# Altium schematic sheet SP26_FindingTitan_Filt&post_Amp_Michael_Krueger.SchDoc
size A; SheetNumber: 2; SheetTotal: 6
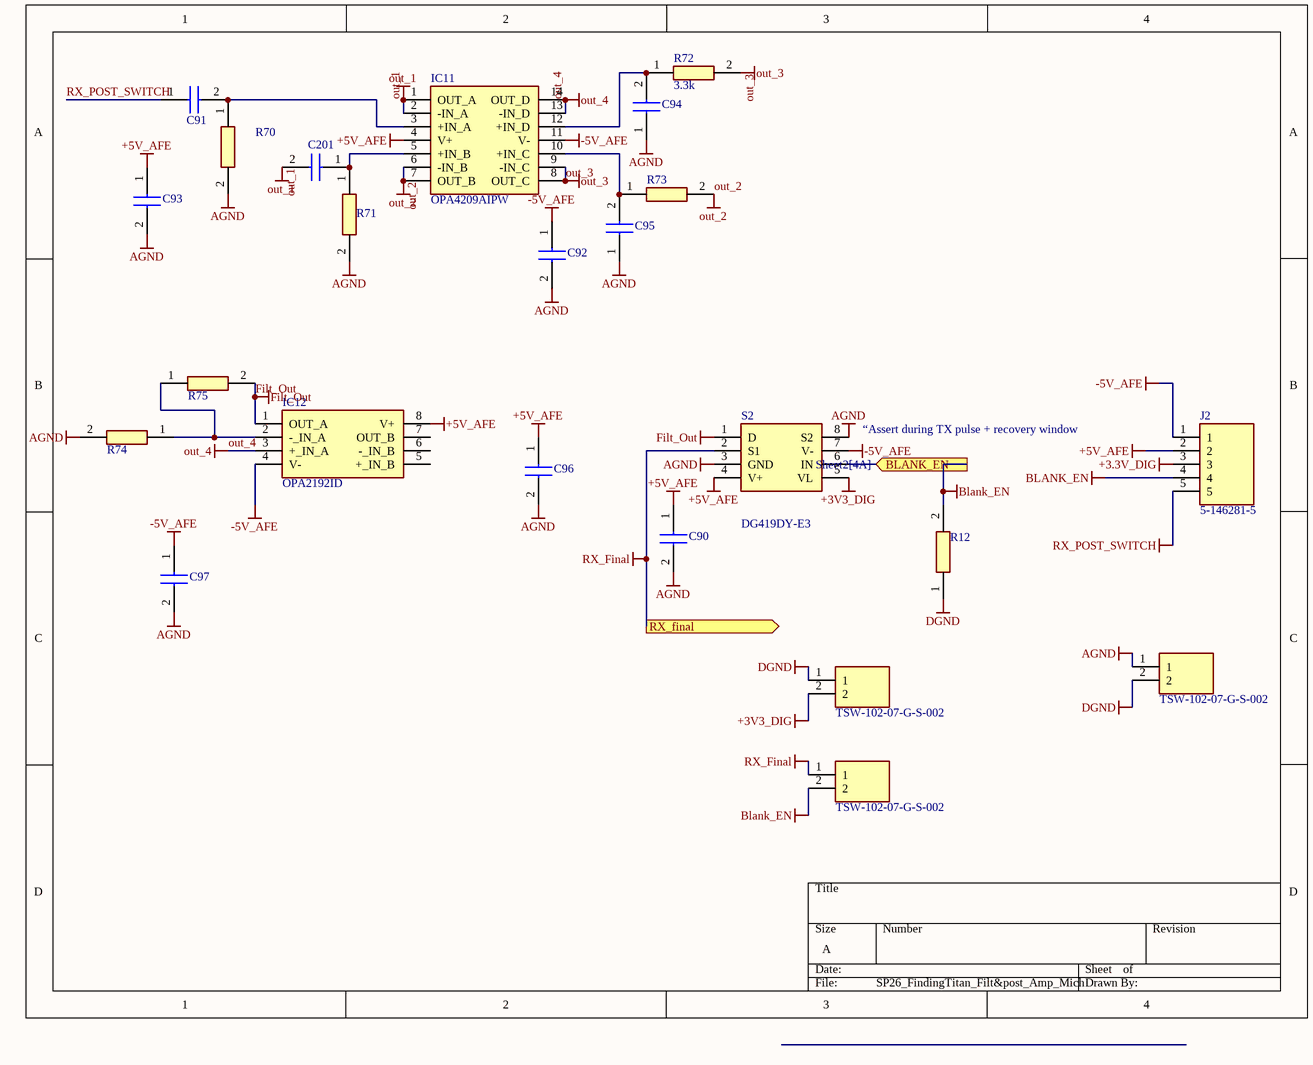
[diagram p0: SP26_FindingTitan_Filt&post_Amp_Michael_Krueger.SchDoc]

## Parts
C90  GRM188R71H104KA93B  [CAPC1608X90N]  (value not drawn)
C91  GCM1885C1H103JA16D  [CAPC1608X90N]  (value not drawn)
C92  GRM188R71H104KA93B  [CAPC1608X90N]  (value not drawn)
C93  GRM188R71H104KA93B  [CAPC1608X90N]  (value not drawn)
C94  GCM1885C1H103JA16D  [CAPC1608X90N]  (value not drawn)
C95  GCM1885C1H103JA16D  [CAPC1608X90N]  (value not drawn)
C96  GRM188R71H104KA93B  [CAPC1608X90N]  (value not drawn)
C97  GRM188R71H104KA93B  [CAPC1608X90N]  (value not drawn)
C201  GCM1885C1H103JA16D  [CAPC1608X90N]  (value not drawn)
IC11  OPA4209AIPW  [SOP65P640X120-14N]
IC12  OPA2192ID  [SOIC127P600X175-8N]
J0  TSW-102-07-G-S-002  [HDRV2W64P0X254_1X2_508X254X838P]
J2  5-146281-5  [HDRV5W67P0X254_1X5_1229X234X821P]
J22  TSW-102-07-G-S-002  [HDRV2W64P0X254_1X2_508X254X838P]
J69  TSW-102-07-G-S-002  [HDRV2W64P0X254_1X2_508X254X838P]
R12  TNPW0805100KBEEA  [RESC2012X55N]  (value not drawn)
R70  20k  [RESC1608X60N]  (value not drawn)
R71  20k  [RESC1608X60N]  (value not drawn)
R72  3.3k  [RESC1608X60N]
R73  3.3k  [RESC1608X60N]  (value not drawn)
R74  20k  [RESC1608X60N]  (value not drawn)
R75  20k  [RESC1608X60N]  (value not drawn)
S2  DG419DY-E3  [SOIC127P600X175-8N]

## Ports
BLANK_EN (in, see Sheet2[4A]), RX_final (out)

## Nets
+3.3V_DIG: J2.3
+3V3_DIG: J69.2 S2.5(VL)
+5V_AFE: C90.1 C93.1 C96.1 IC11.4(V+) IC12.8(V+) J2.2 S2.4(V+)
-5V_AFE: C92.1 C97.1 IC11.11(V-) IC12.4(V-) J2.1 S2.7(V-)
AGND: C90.2 C92.2 C93.2 C94.1 C95.1 C96.2 C97.2 J22.1 R70.2(R2) R71.2(R2) R74.2(R2) S2.3(GND) S2.8(S2)
BLANK_EN: J0.2 J2.4 R12.2 S2.6(IN) ; port BLANK_EN
DGND: J22.2 J69.1 R12.1
Filt_Out: IC12.1(OUT_A) R75.2(R2) S2.1(D)
out_1: C201.2 IC11.1(OUT_A) IC11.2(-IN_A)
out_2: IC11.6(-IN_B) IC11.7(OUT_B) R73.2(R2)
out_3: IC11.8(OUT_C) IC11.9(-IN_C) R72.2(R2)
out_4: IC11.13(-IN_D) IC11.14(OUT_D) IC12.3(+_IN_A)
RX_Final: J0.1 S2.2(S1) ; port RX_final
RX_POST_SWITCH: C91.1 J2.5
NetC91_2: C91.2 IC11.3(+IN_A) R70.1(R1)
NetC94_2: C94.2 IC11.12(+IN_D) R72.1(R1)
NetC95_2: C95.2 IC11.10(+IN_C) R73.1(R1)
NetC201_1: C201.1 IC11.5(+IN_B) R71.1(R1)
NetIC12_2: IC12.2(-_IN_A) R74.1(R1) R75.1(R1)

Not connected (* = marked no-connect by the designer): IC12 5(+_IN_B) 6(-_IN_B) 7(OUT_B)

## Notes on the sheet
- (near S2) “Assert during TX pulse + recovery window

## Library data of the parts
C90 C92 C93 C96 C97 = GRM188R71H104KA93B: Capacitor; Manufacturer_Name: Murata Electronics; Datasheet Link: http://componentsearchengine.com/Datasheets/1/GRM188R71H104KA93B.pdf; Height: 0.9mm; Manufacturer_Part_Number: GRM188R71H104KA93B; Mouser Part Number: N/A; Mouser Price/Stock: https://www.mouser.co.uk/ProductDetail/Murata-Electronics/GRM188R71H104KA93B?qs=UOvNgVTuGCrHGVnSgRWyLQ%3D%3D
C91 C94 C95 C201 = GCM1885C1H103JA16D: Capacitor; Manufacturer_Name: Murata Electronics; Datasheet Link: https://search.murata.co.jp/Ceramy/image/img/A01X/G101/ENG/GCM1885C1H103JA16-01A.pdf; Height: 0.9mm; Manufacturer_Part_Number: GCM1885C1H103JA16D; Mouser Part Number: N/A; Mouser Price/Stock: https://www.mouser.com/Search/Refine.aspx?Keyword=N%2FA
IC11 = OPA4209AIPW: Integrated Circuit; Manufacturer_Name: Texas Instruments; Datasheet Link: http://www.ti.com/lit/ds/symlink/opa4209.pdf; Height: 1.2mm; Manufacturer_Part_Number: OPA4209AIPW; Mouser Part Number: 595-OPA4209AIPW; Mouser Price/Stock: https://www.mouser.co.uk/ProductDetail/Texas-Instruments/OPA4209AIPW?qs=hEBn5lgDlCqr0lWeKFs%252BSA%3D%3D; Arrow Part Number: OPA4209AIPW; Arrow Price/Stock: https://www.arrow.com/en/products/opa4209aipw/texas-instruments?region=nac
IC12 = OPA2192ID: Integrated Circuit; Manufacturer_Name: Texas Instruments; Datasheet Link: http://www.ti.com/lit/ds/symlink/opa2192.pdf; Height: 1.75mm; Manufacturer_Part_Number: OPA2192ID; Mouser Part Number: 595-OPA2192ID; Mouser Price/Stock: https://www.mouser.co.uk/ProductDetail/Texas-Instruments/OPA2192ID?qs=U0ECReq1GB8SZ%252BXtlidzLA%3D%3D; Arrow Part Number: OPA2192ID; Arrow Price/Stock: https://www.arrow.com/en/products/opa2192id/texas-instruments?utm_currency=USD&region=nac
J0 J22 J69 = TSW-102-07-G-S-002: Connector; Manufacturer_Name: SAMTEC; Datasheet Link: http://suddendocs.samtec.com/prints/tsw-xxx-xx-xxx-x-xx-xxx-mkt.pdf; Height: 8.38mm; Manufacturer_Part_Number: TSW-102-07-G-S-002; Mouser Part Number: 200-TSW-10207GS002; Mouser Price/Stock: https://www.mouser.co.uk/ProductDetail/Samtec/TSW-102-07-G-S-002?qs=icabnvfcbsHvpvHCodBv1Q%3D%3D; Arrow Part Number: TSW-102-07-G-S-002; Arrow Price/Stock: https://www.arrow.com/en/products/tsw-102-07-g-s-002/samtec?utm_currency=USD&region=nac
J2 = 5-146281-5: Connector; Manufacturer_Name: TE Connectivity; Datasheet Link: https://www.te.com/commerce/DocumentDelivery/DDEController?Action=showdoc&DocId=Customer+Drawing%7F146281%7FG2%7Fpdf%7FEnglish%7FENG_CD_146281_G2.pdf%7F5-146281-5; Height: 8.21mm; Manufacturer_Part_Number: 5-146281-5; Mouser Part Number: 571-5-146281-5; Mouser Price/Stock: https://www.mouser.co.uk/ProductDetail/TE-Connectivity/5-146281-5?qs=bwpFY26eRVcDY9brDBVAcw%3D%3D; Arrow Part Number: 5-146281-5; Arrow Price/Stock: https://www.arrow.com/en/products/5-146281-5/te-connectivity?region=nac
R12 = TNPW0805100KBEEA: Resistor; Manufacturer_Name: Vishay; Datasheet Link: http://www.farnell.com/datasheets/2609085.pdf; Height: 0.55mm; Manufacturer_Part_Number: TNPW0805100KBEEA; Mouser Part Number: 71-TNPW0805100KBEEA; Mouser Price/Stock: https://www.mouser.co.uk/ProductDetail/Vishay-Dale/TNPW0805100KBEEA?qs=CqEPuS5aiX%252B%2Fw%252BT8t4N3Zg%3D%3D; Arrow Part Number: TNPW0805100KBEEA; Arrow Price/Stock: https://www.arrow.com/en/products/tnpw0805100kbeea/vishay?region=nac
R70 R71 R74 R75 = RR0816P-103-D: Resistor; Manufacturer_Name: Susumu; Datasheet Link: http://componentsearchengine.com/Datasheets/1/RR0816P-103-D.pdf; Manufacturer_Part_Number: RR0816P-103-D; Mouser Part Number: 754-RR0816P-103D; Mouser Price/Stock: https://www.mouser.co.uk/ProductDetail/Susumu/RR0816P-103-D?qs=nCAm%252BcMdy9zJFUifGf2vtQ%3D%3D; Arrow Part Number: RR0816P-103-D; Arrow Price/Stock: https://www.arrow.com/en/products/rr0816p-103-d/susumu
R72 R73 = RR0816P-104-D: Resistor; Manufacturer_Name: Susumu; Manufacturer_Part_Number: RR0816P-104-D; Mouser Part Number: 754-RR0816P-104D; Mouser Price/Stock: https://www.mouser.co.uk/ProductDetail/Susumu/RR0816P-104-D?qs=nCAm%252BcMdy9zS9%252B5cT%2FC83A%3D%3D; Arrow Part Number: RR0816P-104-D; Arrow Price/Stock: https://www.arrow.com/en/products/rr0816p-104-d/susumu
S2 = DG419DY-E3: Switch; Manufacturer_Name: Vishay; Datasheet Link: https://componentsearchengine.com/Datasheets/2/DG419DY-E3.pdf; Height: 1.75mm; Manufacturer_Part_Number: DG419DY-E3; Mouser Part Number: 781-DG419DY-E3; Mouser Price/Stock: https://www.mouser.co.uk/ProductDetail/Vishay-Siliconix/DG419DY-E3?qs=cz8xFaX4kJI2MgO6wGiioA%3D%3D; Arrow Part Number: DG419DY-E3; Arrow Price/Stock: https://www.arrow.com/en/products/dg419dy-e3/vishay?region=nac